# EAGLE schematic HSBD_Schematic v25 (EAGLE 9.7.0)
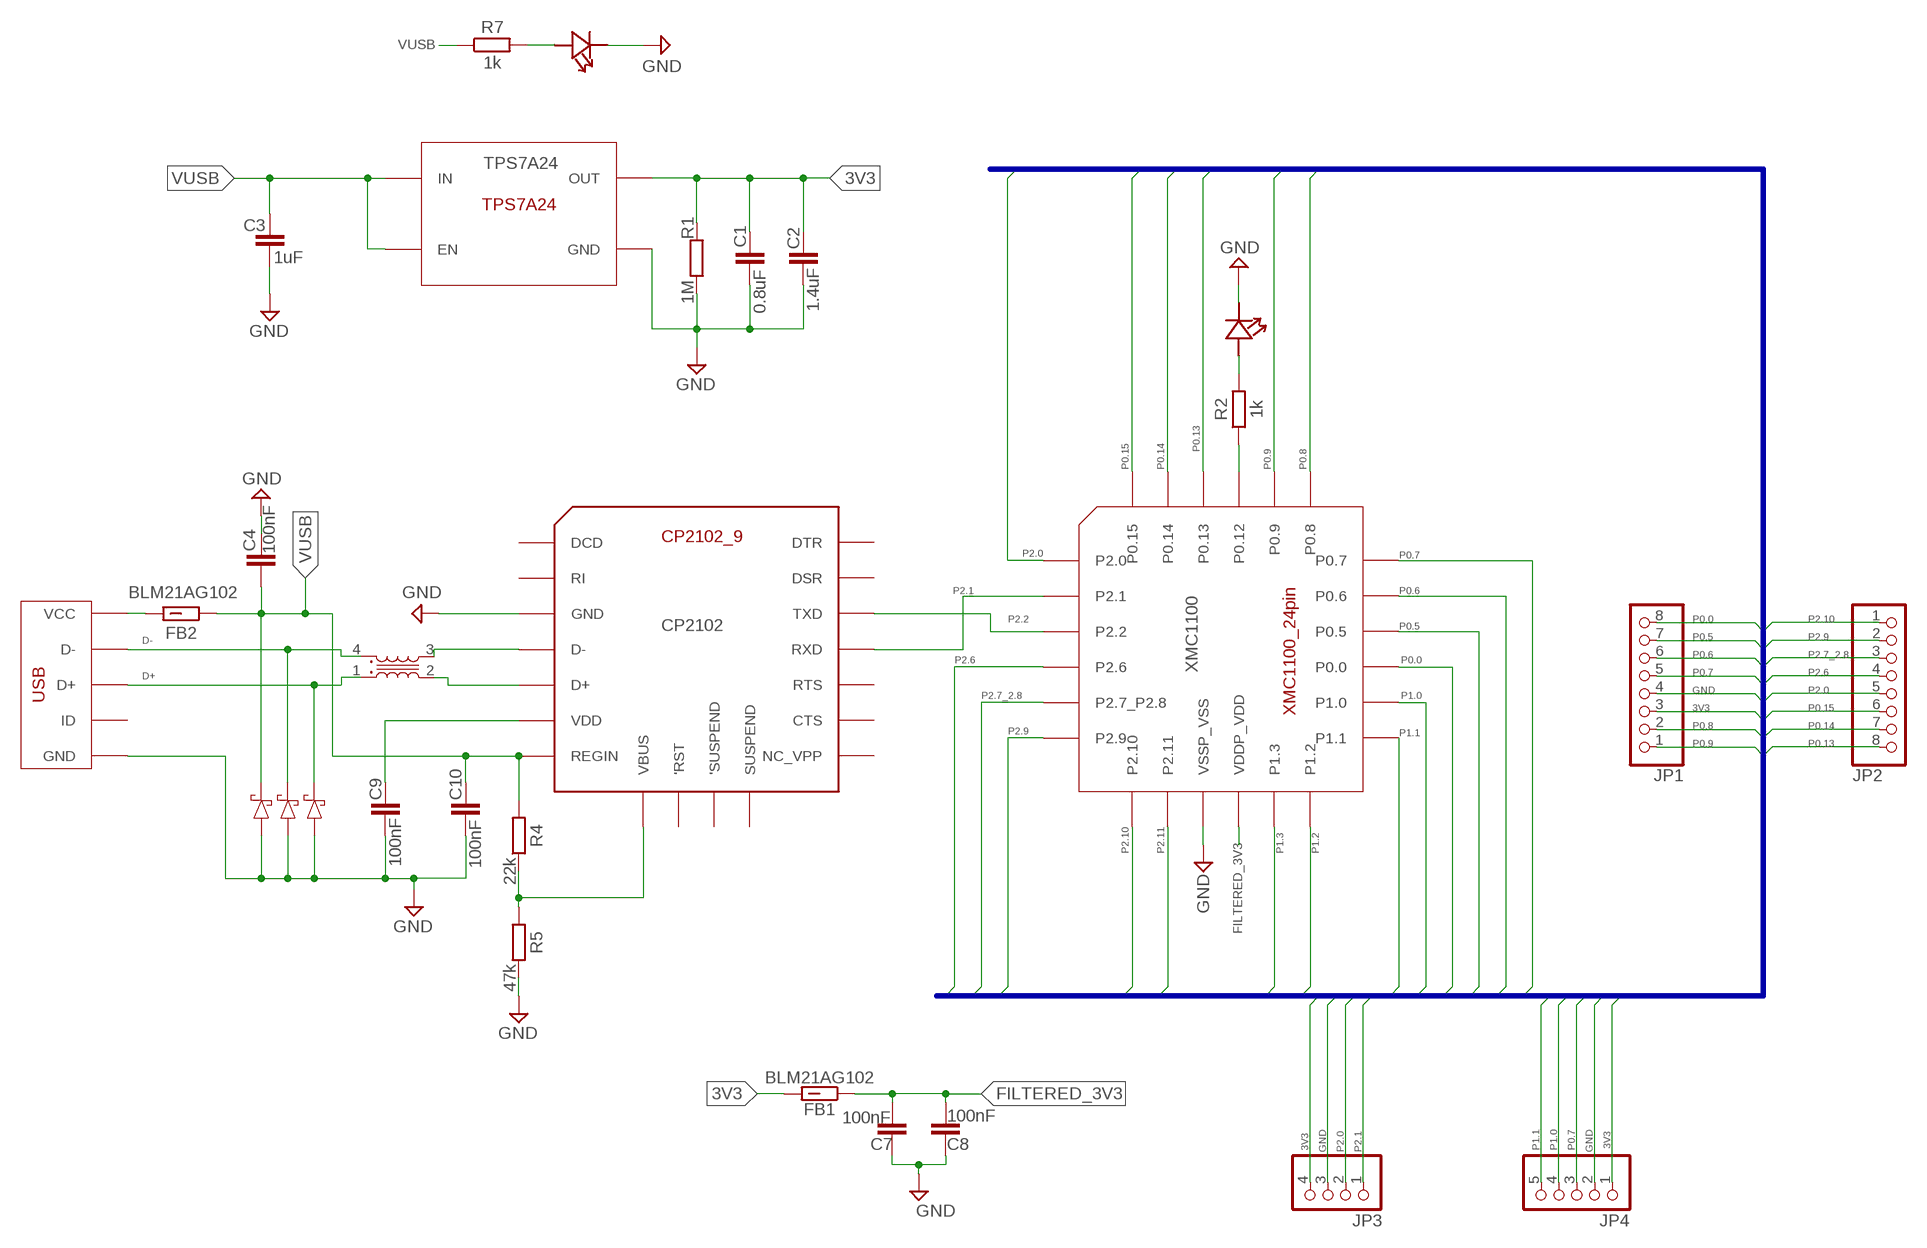
[diagram p0: schematic, sheet 1]

## Parts
C1  0.8uF  C_CHIP-0402(1005-METRIC)  [CAPC1005X60]
C2  1.4uF  C_CHIP-0402(1005-METRIC)  [CAPC1005X60]
C3  1uF  C_CHIP-0402(1005-METRIC)  [CAPC1005X60]
C4  100nF  C_CHIP-0402(1005-METRIC)  [CAPC1005X60]
C7  100nF  C_CHIP-0402(1005-METRIC)  [CAPC1005X60]
C8  100nF  C_CHIP-0402(1005-METRIC)  [CAPC1005X60]
C9  100nF  C_CHIP-0402(1005-METRIC)  [CAPC1005X60]
C10  100nF  C_CHIP-0402(1005-METRIC)  [CAPC1005X60]
FB1  BLM21AG102  FB_BLM21AG102SN1D_0805(2012)  [BEADC2012X105N]
FB2  BLM21AG102  FB_BLM21AG102SN1D_0805(2012)  [BEADC2012X105N]
JP1  PINHD-1X8  [1X08]
JP2  PINHD-1X8  [1X08]
JP3  PINHD-1X4  [1X04]
JP4  PINHD-1X5  [1X05]
R1  1M  R_CHIP-0402(1005-METRIC)  [RESC1005X40]
R2  1k  R_CHIP-0402(1005-METRIC)  [RESC1005X40]
R4  22k  R_CHIP-0402(1005-METRIC)  [RESC1005X40]
R5  47k  R_CHIP-0402(1005-METRIC)  [RESC1005X40]
R7  1k  R_CHIP-0402(1005-METRIC)  [RESC1005X40]
U$1  XMC1100  [XMC1100_PG_VQFN_24]
U$2  CP2102_9  [CP2102_9_QFN-28]
U$3  TPS7A24  [TPS7A24]
U$4  LED0805  [LED0805]
U$5  BAS3010A  [BAS3010A]
U$6  BAS3010A  [BAS3010A]
U$7  BAS3010A  [BAS3010A]
U$9  USB_MINI_B  [USB_MINI_B]
U$10  WE_CNSV  [WE_CNSV]
U$12  LED0805  [LED0805]

## Nets
3V3: C1.1 C2.1 FB1.2 JP1.3 JP3.4 JP4.1 R1.2 U$3.OUT
D+: U$7.OUT U$9.D+ U$10.1
D-: U$6.OUT U$9.D- U$10.4
FILTERED_3V3: C7.2 C8.2 FB1.1 U$1.VDDP_VDD
GND: C1.2 C2.2 C3.2 C4.2 C7.1 C8.1 C9.1 C10.1 JP1.4 JP3.3 JP4.2 R1.1 R5.1 U$1.VSSP_VSS U$2.GND U$3.GND U$4.GND U$5.IN U$6.IN U$7.IN U$9.GND U$12.GND
N$1: R7.2 U$12.IN
N$2: R2.2 U$4.IN
N$3: R2.1 U$1.P0.12
N$4: R4.1 R5.2 U$2.VBUS
N$5: C9.2 U$2.VDD
N$11: U$2.D- U$10.3
N$13: U$2.D+ U$10.2
N$16: FB2.2 U$9.VCC
P0.0: JP1.8 U$1.P0.0
P0.5: JP1.7 U$1.P0.5
P0.6: JP1.6 U$1.P0.6
P0.7: JP1.5 JP4.3 U$1.P0.7
P0.8: JP1.2 U$1.P0.8
P0.9: JP1.1 U$1.P0.9
P0.13: JP2.8 U$1.P0.13
P0.14: JP2.7 U$1.P0.14
P0.15: JP2.6 U$1.P0.15
P1.0: JP4.4 U$1.P1.0
P1.1: JP4.5 U$1.P1.1
P1.2: U$1.P1.2
P1.3: U$1.P1.3
P2.0: JP2.5 JP3.2 U$1.P2.0
P2.1: JP3.1 U$1.P2.1 U$2.RXD
P2.2: U$1.P2.2 U$2.TXD
P2.6: JP2.4 U$1.P2.6
P2.7_2.8: JP2.3 U$1.P2.7_P2.8
P2.9: JP2.2 U$1.P2.9
P2.10: JP2.1 U$1.P2.10
P2.11: U$1.P2.11
VUSB: C3.1 C4.1 C10.2 FB2.1 R4.2 R7.1 U$2.REGIN U$3.EN U$3.IN U$5.OUT
Unconnected: U$2.'RST U$2.'SUSPEND U$2.CTS U$2.DCD U$2.DSR U$2.DTR U$2.NC_VPP U$2.RI U$2.RTS U$2.SUSPEND U$9.ID

## Buses
3V3,5V,GND,P0.0,P0.5,P0.6,P0.7,P0.8,P0.9,P0.13,P0.14,P0.15,P1.0,P1.1,P1.2,P1.3,P2.0,P2.1,P2.2,P2.6,P2.7_2.8,P2.9,P2.10,P2.11

## Library data of the parts
C1-C4 C7-C10 = Capacitor:C: Capacitor - Generic; CATEGORY: Capacitor
FB1 FB2 = Filter:FB_: Ferrite Bead - Popular parts; CATEGORY: Filter; DESCRIPTION: FERRITE BEAD 1 KOHM 0805 1LN; MANUFACTURER: Murata Electronics; SUB-CATEGORY: Ferrite bead
JP1 JP2 = Connector:PINHD-1X8: PIN HEADER; CATEGORY: Headers; DESCRIPTION: Header, Straight, 8 Position; MANUFACTURER: Generic; MPN: Generic; OPERATING_TEMPERATURE: Generic; PART_STATUS: Active; PITCH: 0.100" (2.54mm); ROHS_COMPLIANCE: Generic; SERIES: Generic; SUB-CATEGORY: Headers, Male Pins; TYPE: Board to Board or Cable, Unshrouded, Through Hole, Straight
JP3 = Connector:PINHD-1X4: PIN HEADER; CATEGORY: Headers; DESCRIPTION: Header, Straight, 4 Position; MANUFACTURER: Generic; MPN: Generic; OPERATING_TEMPERATURE: Generic; PART_STATUS: Active; PITCH: 0.100" (2.54mm); ROHS_COMPLIANCE: Generic; SERIES: Generic; SUB-CATEGORY: Headers, Male Pins; TYPE: Board to Board or Cable, Unshrouded, Through Hole, Straight
JP4 = Connector:PINHD-1X5: PIN HEADER; CATEGORY: Headers; DESCRIPTION: Header, Straight, 5 Position; MANUFACTURER: Generic; MPN: Generic; OPERATING_TEMPERATURE: Generic; PART_STATUS: Active; PITCH: 0.100" (2.54mm); ROHS_COMPLIANCE: Generic; SERIES: Generic; SUB-CATEGORY: Headers, Male Pins; TYPE: Board to Board or Cable, Unshrouded, Through Hole, Straight
R1 R2 R4 R5 R7 = Resistor:R: Resistor Fixed - Generic; CATEGORY: Resistor; SUB-CATEGORY: Fixed
U$1 = LIBRARY_embedded_software_systems:XMC1100: Infineon XMC1100 MCU
U$2 = LIBRARY_embedded_software_systems:CP2102_9: CP2102 USB To Serial Interface
U$3 = LIBRARY_embedded_software_systems:TPS7A24: Linear Dropout Voltage Regulator
U$4 U$12 = LIBRARY_embedded_software_systems:LED0805: 0805 LED
U$5-U$7 = LIBRARY_embedded_software_systems:BAS3010A
U$9 = LIBRARY_embedded_software_systems:USB_MINI_B: USB Port
U$10 = LIBRARY_embedded_software_systems:WE_CNSV: Würth Elektronik Common Mode Line Filter